# EAGLE design FarmControl (EAGLE 9.6.2)
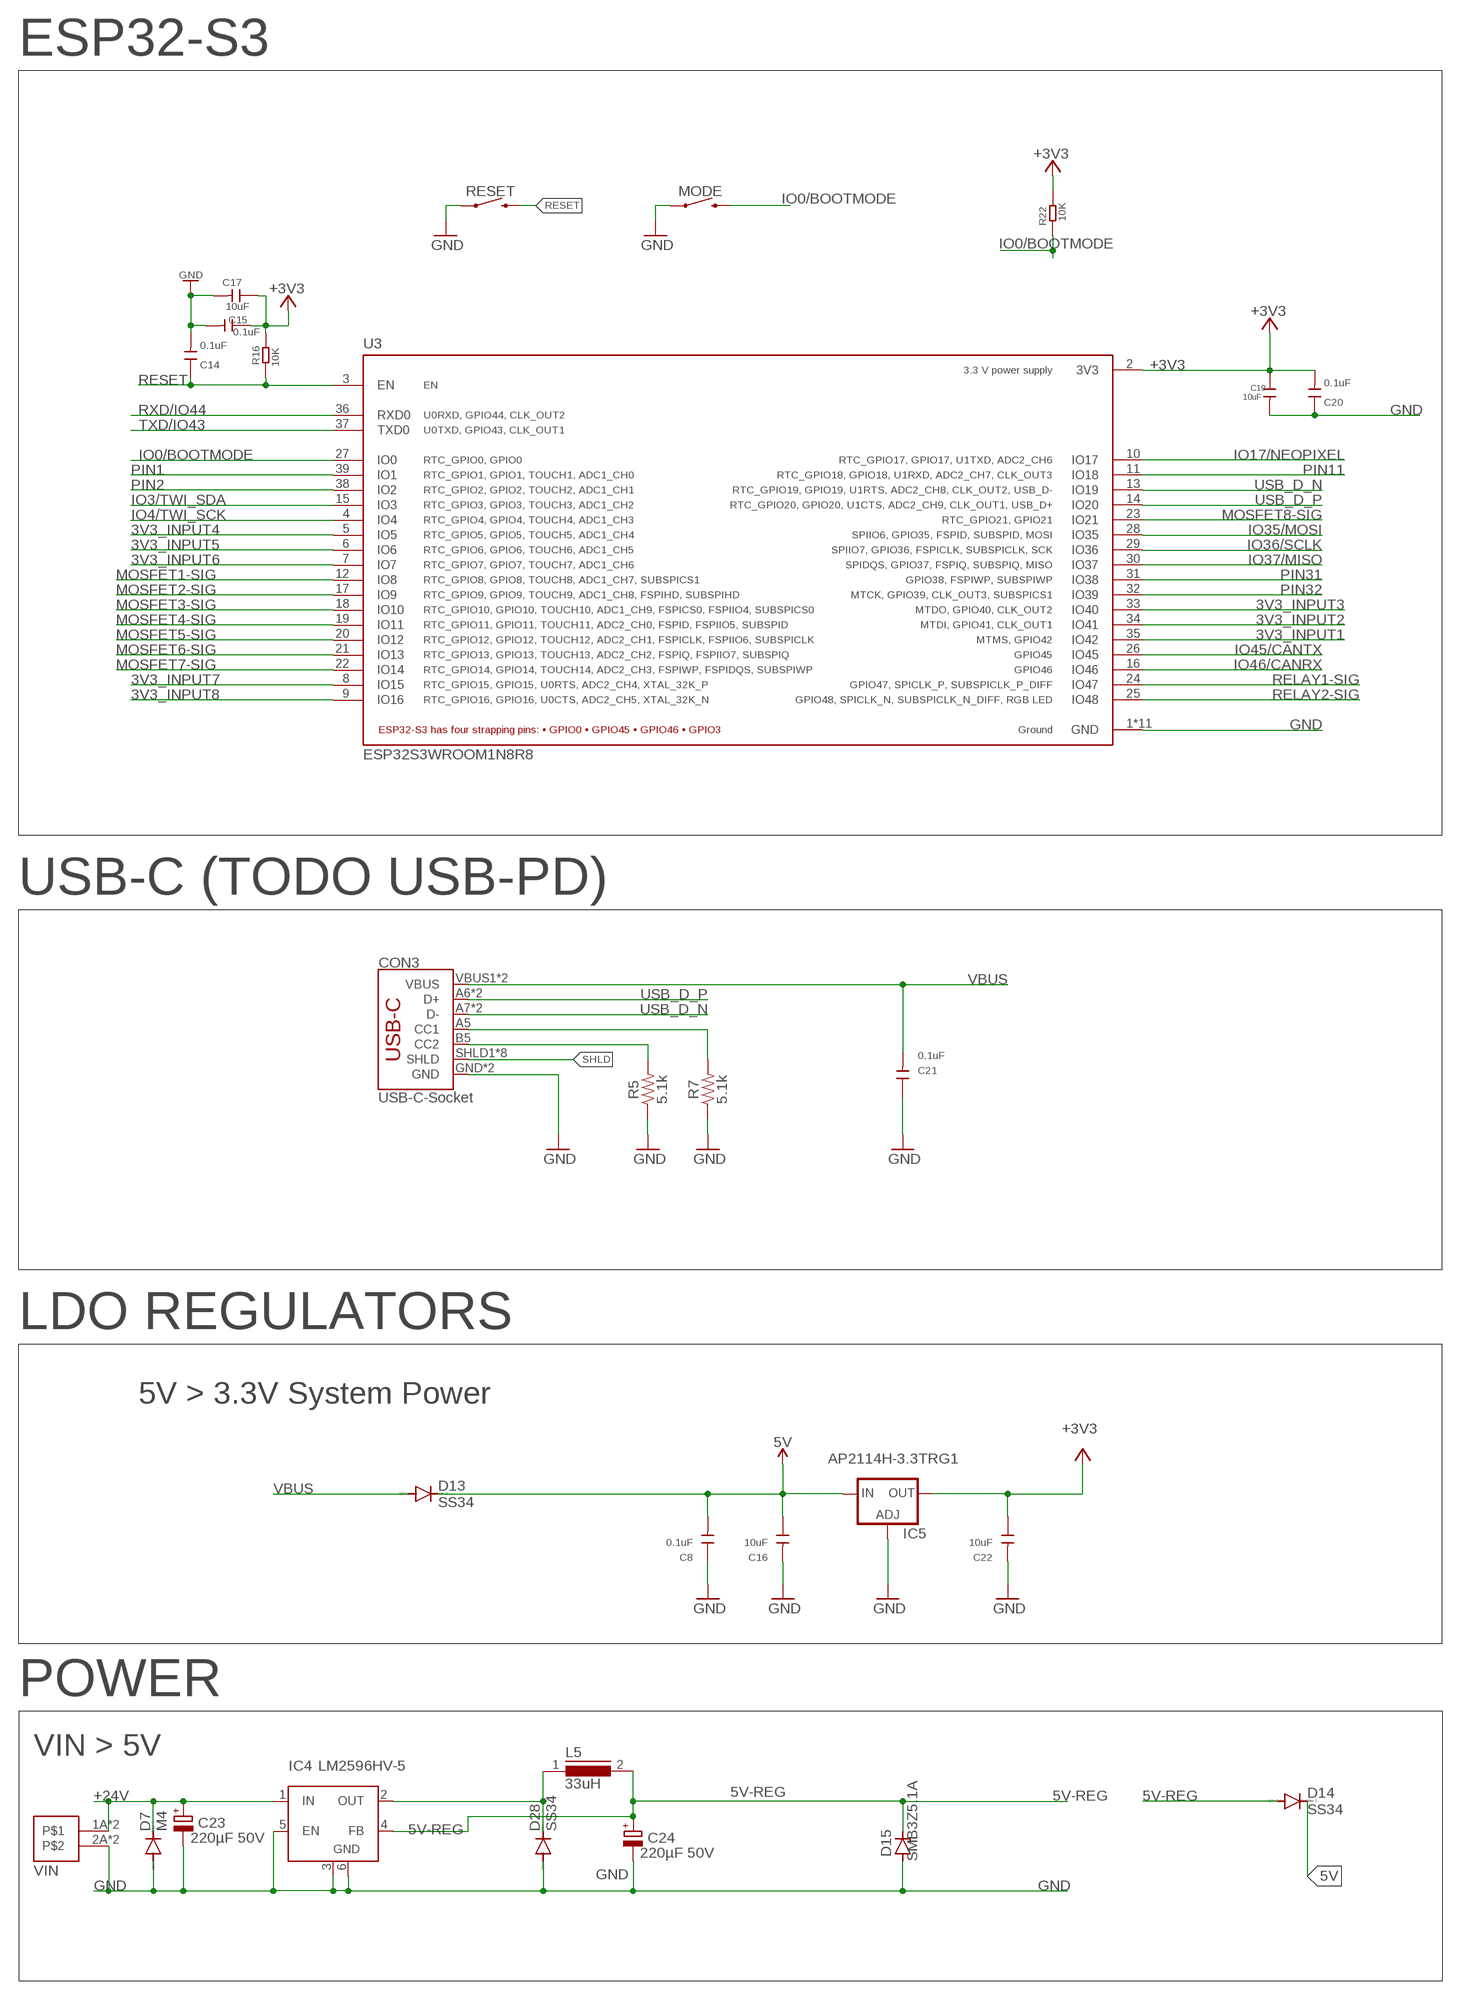
[diagram p0: schematic, sheet 1, part 1 of 3]
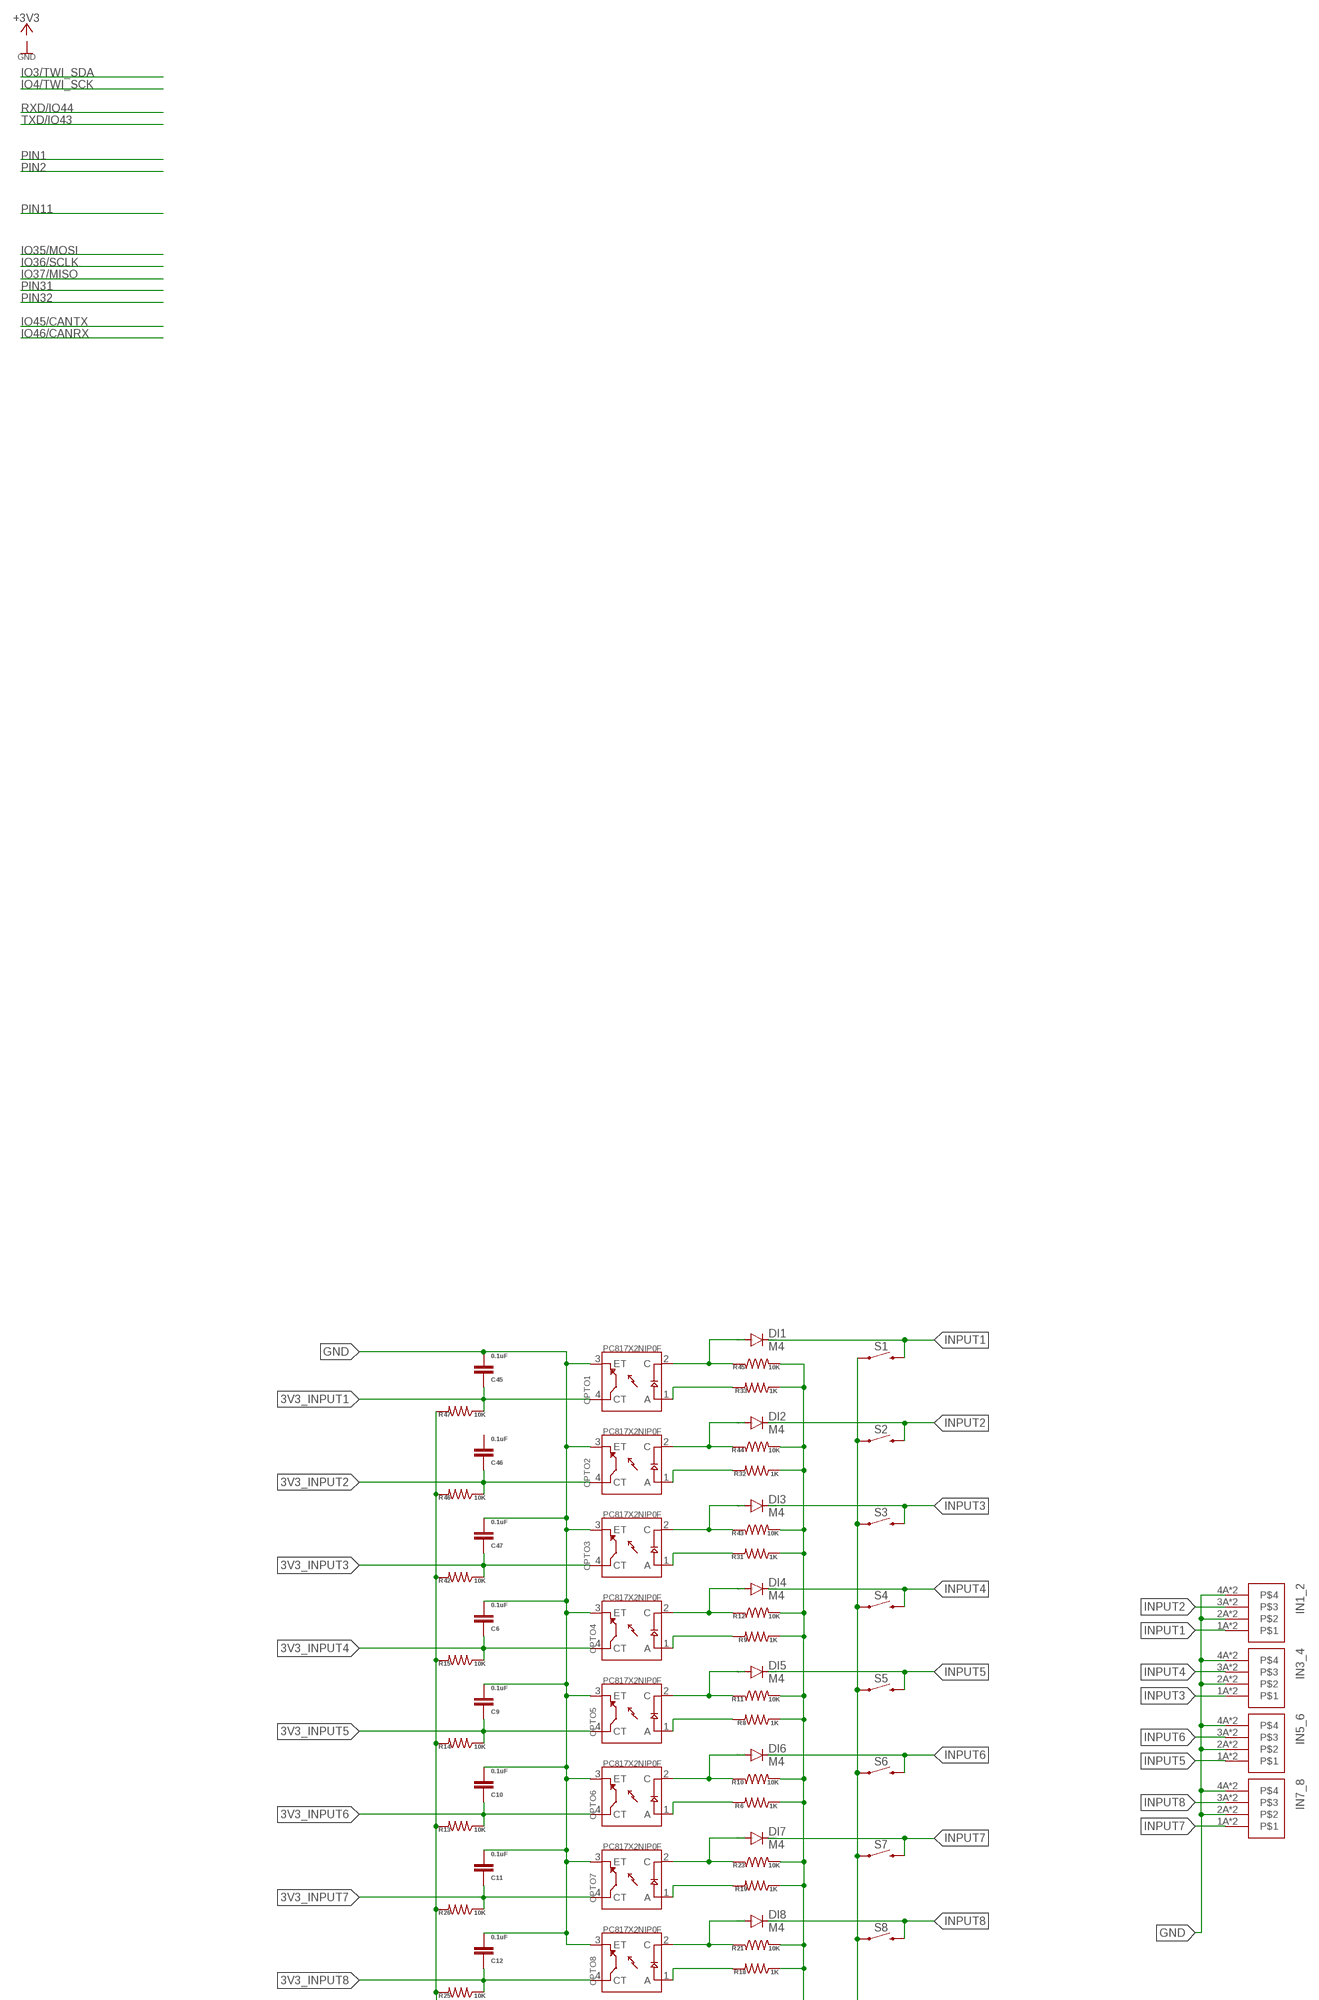
[diagram p1: schematic, sheet 1, part 2 of 3]
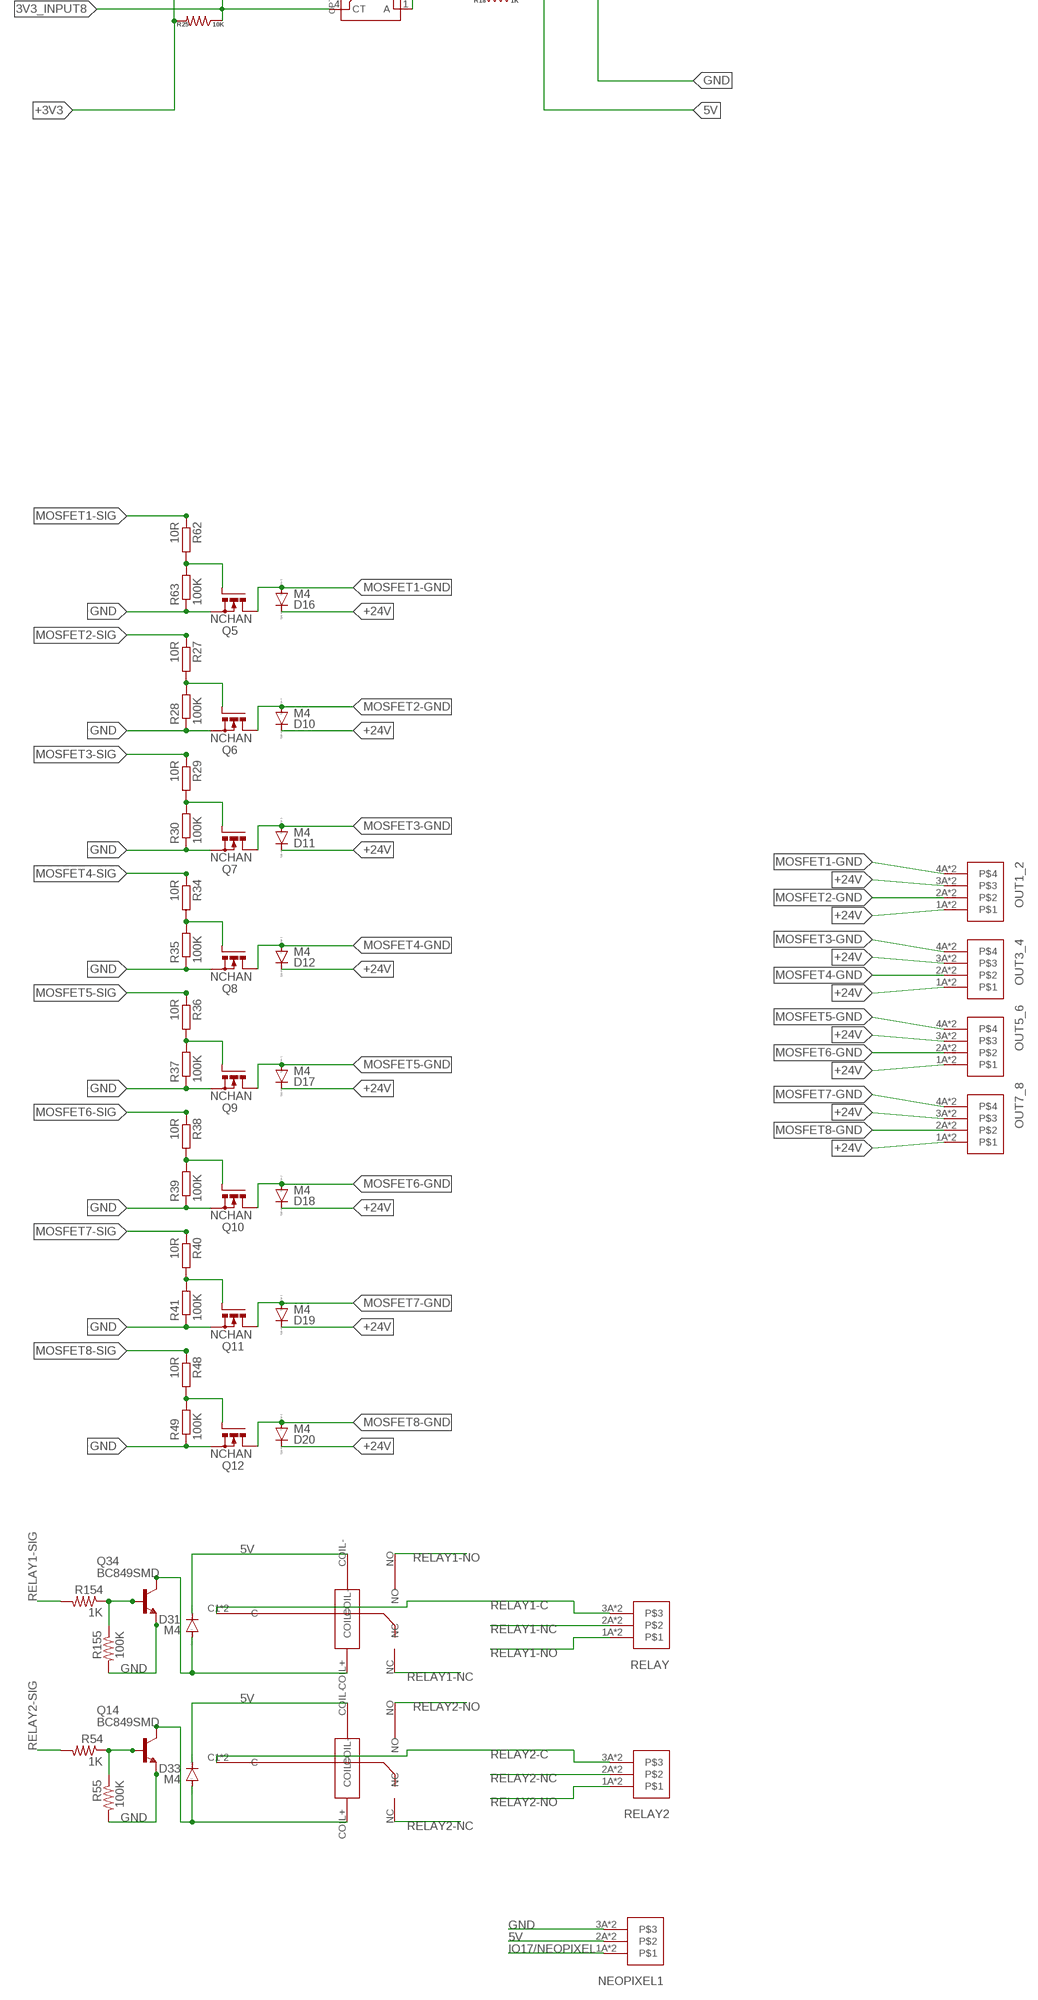
[diagram p2: schematic, sheet 1, part 3 of 3]

## Parts
C6  0.1uF  C-EUC1206  [C1206]
C8  0.1uF  DISCRETE_C-1206  [DISCRETE_C1206]
C9  0.1uF  C-EUC1206  [C1206]
C10  0.1uF  C-EUC1206  [C1206]
C11  0.1uF  C-EUC1206  [C1206]
C12  0.1uF  C-EUC1206  [C1206]
C14  0.1uF  DISCRETE_C-1206  [DISCRETE_C1206]
C15  0.1uF  DISCRETE_C-1206  [DISCRETE_C1206]
C16  10uF  C-1206  [C1206]
C17  10uF  DISCRETE_C-1206  [DISCRETE_C1206]
C19  10uF  C-1206  [C1206]
C20  0.1uF  DISCRETE_C-1206  [DISCRETE_C1206]
C21  0.1uF  DISCRETE_C-1206  [DISCRETE_C1206]
C22  10uF  C-1206  [C1206]
C23  220µF 50V  CPOL-EUE  [PANASONIC_E]
C24  220µF 50V  CPOL-EUE  [PANASONIC_E]
C45  0.1uF  C-EUC1206  [C1206]
C46  0.1uF  C-EUC1206  [C1206]
C47  0.1uF  C-EUC1206  [C1206]
CON3  USB-C-Socket  USB_C16PIN  [USB-C-16P]
D7  M4  DIODE-DO-214AC  [DO-214AC]
D10  M4  DIODE-DO-214AC  [DO-214AC]
D11  M4  DIODE-DO-214AC  [DO-214AC]
D12  M4  DIODE-DO-214AC  [DO-214AC]
D13  SS34  DIODE-DO-214AC  [DO-214AC]
D14  SS34  DIODE-SMB  [SMB]
D15  SMB3Z5.1A  ZENER-DIODESMB  [SMB]
D16  M4  DIODE-DO-214AC  [DO-214AC]
D17  M4  DIODE-DO-214AC  [DO-214AC]
D18  M4  DIODE-DO-214AC  [DO-214AC]
D19  M4  DIODE-DO-214AC  [DO-214AC]
D20  M4  DIODE-DO-214AC  [DO-214AC]
D28  SS34  DIODE-SMB  [SMB]
D31  M4  DIODE-DO-214AC  [DO-214AC]
D33  M4  DIODE-DO-214AC  [DO-214AC]
DI1  M4  DIODE-DO-214AC  [DO-214AC]
DI2  M4  DIODE-DO-214AC  [DO-214AC]
DI3  M4  DIODE-DO-214AC  [DO-214AC]
DI4  M4  DIODE-DO-214AC  [DO-214AC]
DI5  M4  DIODE-DO-214AC  [DO-214AC]
DI6  M4  DIODE-DO-214AC  [DO-214AC]
DI7  M4  DIODE-DO-214AC  [DO-214AC]
DI8  M4  DIODE-DO-214AC  [DO-214AC]
IC4  LM2596HV-5  LM2596S  [TO263-5]
IC5  AP2114H-3.3TRG1  LD117AS33TR  [SOT223]
IN1_2  WJ212R-THR-3.5-4  [WJ212R-THR-3.5-4]
IN3_4  WJ212R-THR-3.5-4  [WJ212R-THR-3.5-4]
IN5_6  WJ212R-THR-3.5-4  [WJ212R-THR-3.5-4]
IN7_8  WJ212R-THR-3.5-4  [WJ212R-THR-3.5-4]
L5  33uH  DR127  [DR127]
MODE  MOMENTARY-SWITCH-SPST-PTH-6.0MM  [TACTILE_SWITCH_PTH_6.0MM]
NEOPIXEL1  WJ212R-THR-3.5-3  [WJ212R-THR-3.5-3]
OPTO1  PC817X2NIP0F  [SOT254P975X400-4N]
OPTO2  PC817X2NIP0F  [SOT254P975X400-4N]
OPTO3  PC817X2NIP0F  [SOT254P975X400-4N]
OPTO4  PC817X2NIP0F  [SOT254P975X400-4N]
OPTO5  PC817X2NIP0F  [SOT254P975X400-4N]
OPTO6  PC817X2NIP0F  [SOT254P975X400-4N]
OPTO7  PC817X2NIP0F  [SOT254P975X400-4N]
OPTO8  PC817X2NIP0F  [SOT254P975X400-4N]
OUT1_2  WJ212R-THR-3.5-4  [WJ212R-THR-3.5-4]
OUT3_4  WJ212R-THR-3.5-4  [WJ212R-THR-3.5-4]
OUT5_6  WJ212R-THR-3.5-4  [WJ212R-THR-3.5-4]
OUT7_8  WJ212R-THR-3.5-4  [WJ212R-THR-3.5-4]
Q5  NCHAN  N-POWER-MOSFETDPAK-MOSFET  [D-PAK_TO252AA]
Q6  NCHAN  N-POWER-MOSFETDPAK-MOSFET  [D-PAK_TO252AA]
Q7  NCHAN  N-POWER-MOSFETDPAK-MOSFET  [D-PAK_TO252AA]
Q8  NCHAN  N-POWER-MOSFETDPAK-MOSFET  [D-PAK_TO252AA]
Q9  NCHAN  N-POWER-MOSFETDPAK-MOSFET  [D-PAK_TO252AA]
Q10  NCHAN  N-POWER-MOSFETDPAK-MOSFET  [D-PAK_TO252AA]
Q11  NCHAN  N-POWER-MOSFETDPAK-MOSFET  [D-PAK_TO252AA]
Q12  NCHAN  N-POWER-MOSFETDPAK-MOSFET  [D-PAK_TO252AA]
Q14  BC849SMD  [SOT23-BEC]
Q34  BC849SMD  [SOT23-BEC]
R5  5.1k  5.1KOHM5.1KOHM-0603-1/10W-1%  [0603@1]
R6  1K  R-US_R1206  [R1206]
R7  5.1k  5.1KOHM5.1KOHM-0603-1/10W-1%  [0603@1]
R8  1K  R-US_R1206  [R1206]
R9  1K  R-US_R1206  [R1206]
R10  10K  R-US_R1206  [R1206]
R11  10K  R-US_R1206  [R1206]
R12  10K  R-US_R1206  [R1206]
R13  10K  R-US_R1206  [R1206]
R14  10K  R-US_R1206  [R1206]
R15  10K  R-US_R1206  [R1206]
R16  10K  R-1206  [R1206]
R18  1K  R-US_R1206  [R1206]
R19  1K  R-US_R1206  [R1206]
R21  10K  R-US_R1206  [R1206]
R22  10K  R-1206  [R1206]
R23  10K  R-US_R1206  [R1206]
R25  10K  R-US_R1206  [R1206]
R26  10K  R-US_R1206  [R1206]
R27  10R  R-EU_R1206  [R1206]
R28  100K  R-EU_R1206  [R1206]
R29  10R  R-EU_R1206  [R1206]
R30  100K  R-EU_R1206  [R1206]
R31  1K  R-US_R1206  [R1206]
R32  1K  R-US_R1206  [R1206]
R33  1K  R-US_R1206  [R1206]
R34  10R  R-EU_R1206  [R1206]
R35  100K  R-EU_R1206  [R1206]
R36  10R  R-EU_R1206  [R1206]
R37  100K  R-EU_R1206  [R1206]
R38  10R  R-EU_R1206  [R1206]
R39  100K  R-EU_R1206  [R1206]
R40  10R  R-EU_R1206  [R1206]
R41  100K  R-EU_R1206  [R1206]
R42  10K  R-US_R1206  [R1206]
R43  10K  R-US_R1206  [R1206]
R44  10K  R-US_R1206  [R1206]
R45  10K  R-US_R1206  [R1206]
R46  10K  R-US_R1206  [R1206]
R47  10K  R-US_R1206  [R1206]
R48  10R  R-EU_R1206  [R1206]
R49  100K  R-EU_R1206  [R1206]
R54  1K  R-US_R1206  [R1206]
R55  100K  R-US_R1206  [R1206]
R62  10R  R-EU_R1206  [R1206]
R63  100K  R-EU_R1206  [R1206]
R154  1K  R-US_R1206  [R1206]
R155  100K  R-US_R1206  [R1206]
RELAY  WJ212R-THR-3.5-3  [WJ212R-THR-3.5-3]
RELAY2  WJ212R-THR-3.5-3  [WJ212R-THR-3.5-3]
RESET  MOMENTARY-SWITCH-SPST-PTH-6.0MM  [TACTILE_SWITCH_PTH_6.0MM]
S1  MOMENTARY-SWITCH-SPST-PTH-6.0MM  [TACTILE_SWITCH_PTH_6.0MM]
S2  MOMENTARY-SWITCH-SPST-PTH-6.0MM  [TACTILE_SWITCH_PTH_6.0MM]
S3  MOMENTARY-SWITCH-SPST-PTH-6.0MM  [TACTILE_SWITCH_PTH_6.0MM]
S4  MOMENTARY-SWITCH-SPST-PTH-6.0MM  [TACTILE_SWITCH_PTH_6.0MM]
S5  MOMENTARY-SWITCH-SPST-PTH-6.0MM  [TACTILE_SWITCH_PTH_6.0MM]
S6  MOMENTARY-SWITCH-SPST-PTH-6.0MM  [TACTILE_SWITCH_PTH_6.0MM]
S7  MOMENTARY-SWITCH-SPST-PTH-6.0MM  [TACTILE_SWITCH_PTH_6.0MM]
S8  MOMENTARY-SWITCH-SPST-PTH-6.0MM  [TACTILE_SWITCH_PTH_6.0MM]
U3  ESP32S3WROOM1N8R8  [XCVR_ESP32S3WROOM1N8R8]
U$1  JRC-21F-4100  [JRC-21F-4100]
U$3  JRC-21F-4100  [JRC-21F-4100]
VIN  WJ212R-THR-3.5-2  [WJ212R-THR-3.5-2]

## Nets
3V3_INPUT1: C45.1 OPTO1.4(CT) R47.1 U3.35(IO42)
3V3_INPUT2: C46.1 OPTO2.4(CT) R46.1 U3.34(IO41)
3V3_INPUT3: C47.1 OPTO3.4(CT) R42.1 U3.33(IO40)
3V3_INPUT4: C6.1 OPTO4.4(CT) R15.1 U3.5(IO5)
3V3_INPUT5: C9.1 OPTO5.4(CT) R14.1 U3.6(IO6)
3V3_INPUT6: C10.1 OPTO6.4(CT) R13.1 U3.7(IO7)
3V3_INPUT7: C11.1 OPTO7.4(CT) R26.1 U3.8(IO15)
3V3_INPUT8: C12.1 OPTO8.4(CT) R25.1 U3.9(IO16)
5V: C8.2 C16.1 D13.C D14.C D31.C D33.C IC5.3(IN) NEOPIXEL1.2A NEOPIXEL1.2B R6.1 R8.1 R9.1 R10.2 R11.2 R12.2 R18.1 R19.1 R21.2 R23.2 R31.1 R32.1 R33.1 R43.2 R44.2 R45.2 U$1.COIL- U$3.COIL-
5V-REG: C24.+ D14.A D15.C IC4.4(FB) L5.2
+3V3: C15.1 C17.1 C19.1 C20.2 C22.1 IC5.4(OUT) R13.2 R14.2 R15.2 R16.2 R22.2 R25.2 R26.2 R42.2 R46.2 R47.2 U3.2(3V3)
+24V: C23.+ D7.C D10.C D11.C D12.C D16.C D17.C D18.C D19.C D20.C IC4.1(IN) OUT1_2.1A OUT1_2.1B OUT1_2.3A OUT1_2.3B OUT3_4.1A OUT3_4.1B OUT3_4.3A OUT3_4.3B OUT5_6.1A OUT5_6.1B OUT5_6.3A OUT5_6.3B OUT7_8.1A OUT7_8.1B OUT7_8.3A OUT7_8.3B VIN.1A VIN.1B
CC1: CON3.A5(CC1) R7.2
CC2: CON3.B5(CC2) R5.2
COIL-1: D31.A Q34.C U$3.COIL+(COIL=)
COIL-2: D33.A Q14.C U$1.COIL+(COIL=)
GND: C6.2 C8.1 C9.2 C10.2 C11.2 C12.2 C14.2 C15.2 C16.2 C17.2 C19.2 C20.1 C21.1 C22.2 C23.- C24.- C45.2 C47.2 CON3.GND CON3.GND2(GND) D7.A D15.A D28.A IC4.3(GND) IC4.5(EN) IC4.6(GND) IC5.1(ADJ) IN1_2.2A IN1_2.2B IN1_2.4A IN1_2.4B IN3_4.2A IN3_4.2B IN3_4.4A IN3_4.4B IN5_6.2A IN5_6.2B IN5_6.4A IN5_6.4B IN7_8.2A IN7_8.2B IN7_8.4A IN7_8.4B MODE.1 NEOPIXEL1.3A NEOPIXEL1.3B OPTO1.3(ET) OPTO2.3(ET) OPTO3.3(ET) OPTO4.3(ET) OPTO5.3(ET) OPTO6.3(ET) OPTO7.3(ET) OPTO8.3(ET) Q5.3(S) Q6.3(S) Q7.3(S) Q8.3(S) Q9.3(S) Q10.3(S) Q11.3(S) Q12.3(S) Q14.E Q34.E R5.1 R7.1 R28.1 R30.1 R35.1 R37.1 R39.1 R41.1 R49.1 R55.2 R63.1 R155.2 RESET.1 S1.1 S2.1 S3.1 S4.1 S5.1 S6.1 S7.1 S8.1 U3.1(GND) U3.40(GND) U3.41_1(GND) U3.41_2(GND) U3.41_3(GND) U3.41_4(GND) U3.41_5(GND) U3.41_6(GND) U3.41_7(GND) U3.41_8(GND) U3.41_9(GND) VIN.2A VIN.2B
INPUT1: DI1.C IN1_2.1A IN1_2.1B S1.3
INPUT2: DI2.C IN1_2.3A IN1_2.3B S2.3
INPUT3: DI3.C IN3_4.1A IN3_4.1B S3.3
INPUT4: DI4.C IN3_4.3A IN3_4.3B S4.3
INPUT5: DI5.C IN5_6.1A IN5_6.1B S5.3
INPUT6: DI6.C IN5_6.3A IN5_6.3B S6.3
INPUT7: DI7.C IN7_8.1A IN7_8.1B S7.3
INPUT8: DI8.C IN7_8.3A IN7_8.3B S8.3
IO0/BOOTMODE: MODE.3 R22.1 U3.27(IO0)
IO3/TWI_SDA: U3.15(IO3)
IO4/TWI_SCK: U3.4(IO4)
IO17/NEOPIXEL: NEOPIXEL1.1A NEOPIXEL1.1B U3.10(IO17)
IO35/MOSI: U3.28(IO35)
IO36/SCLK: U3.29(IO36)
IO37/MISO: U3.30(IO37)
IO45/CANTX: U3.26(IO45)
IO46/CANRX: U3.16(IO46)
MOSFET1-GND: D16.A OUT1_2.4A OUT1_2.4B Q5.4(D)
MOSFET1-SIG: R62.1 U3.12(IO8)
MOSFET2-GND: D10.A OUT1_2.2A OUT1_2.2B Q6.4(D)
MOSFET2-SIG: R27.1 U3.17(IO9)
MOSFET3-GND: D11.A OUT3_4.4A OUT3_4.4B Q7.4(D)
MOSFET3-SIG: R29.1 U3.18(IO10)
MOSFET4-GND: D12.A OUT3_4.2A OUT3_4.2B Q8.4(D)
MOSFET4-SIG: R34.1 U3.19(IO11)
MOSFET5-GND: D17.A OUT5_6.4A OUT5_6.4B Q9.4(D)
MOSFET5-SIG: R36.1 U3.20(IO12)
MOSFET6-GND: D18.A OUT5_6.2A OUT5_6.2B Q10.4(D)
MOSFET6-SIG: R38.1 U3.21(IO13)
MOSFET7-GND: D19.A OUT7_8.4A OUT7_8.4B Q11.4(D)
MOSFET7-SIG: R40.1 U3.22(IO14)
MOSFET8-GND: D20.A OUT7_8.2A OUT7_8.2B Q12.4(D)
MOSFET8-SIG: R48.1 U3.23(IO21)
N$9: OPTO6.1(A) R6.2
N$10: OPTO5.1(A) R8.2
N$11: OPTO4.1(A) R9.2
N$12: DI4.A OPTO4.2(C) R12.1
N$13: Q5.1(G) R62.2 R63.2
N$14: DI5.A OPTO5.2(C) R11.1
N$15: DI6.A OPTO6.2(C) R10.1
N$17: OPTO8.1(A) R18.2
N$18: OPTO7.1(A) R19.2
N$19: DI7.A OPTO7.2(C) R23.1
N$20: DI8.A OPTO8.2(C) R21.1
N$22: Q6.1(G) R27.2 R28.2
N$23: Q7.1(G) R29.2 R30.2
N$24: Q8.1(G) R34.2 R35.2
N$26: Q9.1(G) R36.2 R37.2
N$27: Q10.1(G) R38.2 R39.2
N$28: Q11.1(G) R40.2 R41.2
N$29: Q12.1(G) R48.2 R49.2
N$32: Q14.B R54.1 R55.1
N$78: Q34.B R154.1 R155.1
N$149: OPTO3.1(A) R31.2
N$150: OPTO2.1(A) R32.2
N$151: OPTO1.1(A) R33.2
N$152: DI1.A OPTO1.2(C) R45.1
N$153: DI2.A OPTO2.2(C) R44.1
N$154: DI3.A OPTO3.2(C) R43.1
N$164: D28.C IC4.2(OUT) L5.1
PIN1: U3.39(IO1)
PIN2: U3.38(IO2)
PIN11: U3.11(IO18)
PIN31: U3.31(IO38)
PIN32: U3.32(IO39)
RELAY1-C: RELAY.3A RELAY.3B U$3.C1(C) U$3.C2(C)
RELAY1-NC: RELAY.2A RELAY.2B U$3.NC
RELAY1-NO: RELAY.1A RELAY.1B U$3.NO
RELAY1-SIG: R154.2 U3.24(IO47)
RELAY2-C: RELAY2.3A RELAY2.3B U$1.C1(C) U$1.C2(C)
RELAY2-NC: RELAY2.2A RELAY2.2B U$1.NC
RELAY2-NO: RELAY2.1A RELAY2.1B U$1.NO
RELAY2-SIG: R54.2 U3.25(IO48)
RESET: C14.1 R16.1 RESET.3 U3.3(EN)
RXD/IO44: U3.36(RXD0)
SHLD: CON3.SHLD1(SHLD) CON3.SHLD2(SHLD) CON3.SHLD3(SHLD) CON3.SHLD4(SHLD) CON3.SHLD5(SHLD) CON3.SHLD6(SHLD) CON3.SHLD7(SHLD) CON3.SHLD8(SHLD)
TXD/IO43: U3.37(TXD0)
USB_D_N: CON3.A7(D-) CON3.B7(D-) U3.13(IO19)
USB_D_P: CON3.A6(D+) CON3.B6(D+) U3.14(IO20)
VBUS: C21.2 CON3.VBUS1(VBUS) CON3.VBUS2(VBUS) D13.A
Unconnected: C46.2

## Notes on the sheet
- ESP32-S3
- USB-C (TODO USB-PD)
- LDO REGULATORS
- 5V > 3.3V System Power
- POWER
- VIN > 5V

## Library data of the parts
C6 C9-C12 C45-C47 = rcl:C-EU: CAPACITOR, European symbol; SPICEPREFIX: C
C8 C14 C15 C17 C20 C21 = A9G:DISCRETE_C*: Ceramic Capacitors
C16 C19 C22 = discrete:C*: Ceramic Capacitors
C23 C24 = resistor:CPOL-EU: POLARIZED CAPACITOR, European symbol
CON3 = SparkFun-Connectors:USB_C: USB Type C 16Pin Connector Super Speed pins not available on the 16-pin purely SMD connector so this part is best for USB 2.0 implementations. D1 and D2 are tied together enabling D+/- no matter which way the cable is plugged into the connector. The two channel configuration pins (CC1/2) are exposed. These are normally connected to ground via 5.1k resistors but can be reconfigured for high current/high power applications.; PROD_ID: CONN-14122
D7 D10-D14 D16-D20 D28 D31 D33 DI1-DI8 = diode:DIODE-: DIODE
D15 = diode:ZENER-DIODE: Z-Diode
IC4 = linear:LM2596S: STEP-DOWN VOLTAGE REGULATOR
IC5 = v-reg:LD117A?*: Low drop fixed and adjustable positive voltage regulators 1 A Source: http://www.st.com/stonline/products/literature/ds/7194/ld1117axx.pdf
IN1_2 IN3_4 IN5_6 IN7_8 OUT1_2 OUT3_4 OUT5_6 OUT7_8 = WJ212R-THR-3.5-3.81:WJ212R-THR-3.5-4
L5 = inductors:DR127: High Power Density, High Efficiency, Shielded Inductors Source: coiltronics_dr_series.pdf; SPICEPREFIX: L
MODE RESET S1-S8 = SparkFun-Switches:MOMENTARY-SWITCH-SPST: Momentary Switch (Pushbutton) - SPST Normally-open (NO) SPST momentary switches (buttons, pushbuttons). Variants PTH-12MM - 12mm square, through-hole Momentary Pushbutton Switch - 12mm Square <https://www.sparkfun.com/products/9190> (COM-09190) PTH-6.0MM, PTH-6.0MM-KIT - 6.0mm square, through-hole Mini Pushbutton Switch <https://www.sparkfun.com/products/97> (COM-00097) KIT package intended for soldering kit's - only one side of pads' copper is exposed. PTH-RIGHT-ANGLE-KIT - Right-angle, through-hole Right Angle Tactile Button <https://www.sparkfun.com/products/10791> - Used on SparkFun BigTime Watch Kit <https://www.sparkfun.com/products/11734> SMD-12MM - 12mm square, surface-mount Tactile Button - SMD (12mm) <https://www.sparkfun.com/products/12993> (COM-12993) Used on SparkFun PicoBoard <https://www.sparkfun.com/products/11888> SMD-4.5MM - 4.5mm Square Trackball Switch Used on SparkFun Blackberry Trackballer Breakout <https://www.sparkfun.com/products/13169> SMD-4.6MMX2.8MM - 4.60mm x 2.80mm, surface mount Used on SparkFun SAMD21 Mini Breakout <https://www.sparkfun.com/products/13664> SMD-5.2MM, SMD-5.2-REDUNDANT - 5.2mm square, surface-mount Mini Pushbutton Switch - SMD <https://www.sparkfun.com/products/8720> (COM-08720) Used on Arduino Pro Mini <https://www.sparkfun.com/products/11114> REDUNDANT package connects both switch circuits together SMD-6.0X3.5MM - 6.0 x 3.5mm, surface mount Momentary Reset Switch SMD <https://www.sparkfun.com/products/8229> (COM-08229) SMD-6.2MM-TALL - 6.2mm square, surface mount Tactile Button - SMD (6mm) <https://www.sparkfun.com/products/12992> Used on SparkFun Digital Sandbox <https://www.sparkfun.com/products/12651> SMD-RIGHT-ANGLE - Right-angle, surface mount Used on SparkFun Block for Intel® Edison - Arduino <https://www.sparkfun.com/products/13036>; PROD_ID: SWCH-08441; SF_SKU: COM-00097
NEOPIXEL1 RELAY RELAY2 = WJ212R-THR-3.5-3.81:WJ212R-THR-3.5-3
OPTO1-OPTO8 = PC817X2NIP0F:PC817X2NIP0F: PC817 Series 1 Channel 80 V 5000 Vrms General Purpose Photocoupler - DIP-4 Check availability <https://pricing.snapeda.com/parts/PC817X2NIP0F/Sharp%20Microelectronics/view-part?ref=eda>; AVAILABILITY: In Stock; DESCRIPTION: Optoisolator Transistor Output 5000Vrms 1 Channel 4-SMD; MF: Sharp Microelectronics; MP: PC817X2NIP0F; PACKAGE: SMD-4 Sharp; PRICE: None; PURCHASE-URL: https://pricing.snapeda.com/search/part/PC817X2NIP0F/?ref=eda
Q5-Q12 = Cohesion_parts:N-POWER-MOSFET
Q14 Q34 = transistor-npn:BC849*: NPN Transistor
R5 R7 = SparkFun-Resistors:5.1KOHM; PROD_ID: RES-12083
R6 R8-R15 R18 R19 R21 R23 R25 R26 R31-R33 R42-R47 = resistor:R-US_: RESISTOR, American symbol
R16 R22 = discrete:R*
R27-R30 R34-R41 R48 R49 R62 R63 = resistor:R-EU_: RESISTOR, European symbol
R54 R55 R154 R155 = adafruit:R-US_: RESISTOR, American symbol
U3 = ESP32S3WROOM1N8R8:ESP32S3WROOM1N8R8: Check availability <https://pricing.snapeda.com/parts/ESP32S3WROOM1N8R8/Espressif%20Systems/view-part?ref=eda>; AVAILABILITY: In Stock; DESCRIPTION: Bluetooth, WiFi 802.11b/g/n, Bluetooth v5.0 Transceiver Module 2.4GHz PCB Trace Surface Mount; MF: Espressif Systems; MP: ESP32S3WROOM1N8R8; PACKAGE: None; PRICE: None; PURCHASE-URL: https://pricing.snapeda.com/search/part/ESP32S3WROOM1N8R8/?ref=eda
U$1 U$3 = JRC-21F:JRC-21F-4100
VIN = WJ212R-THR-3.5-3.81:WJ212R-THR-3.5-2

## Net classes
0 default: width 0.203 mm, clearance 0.152 mm

## Board
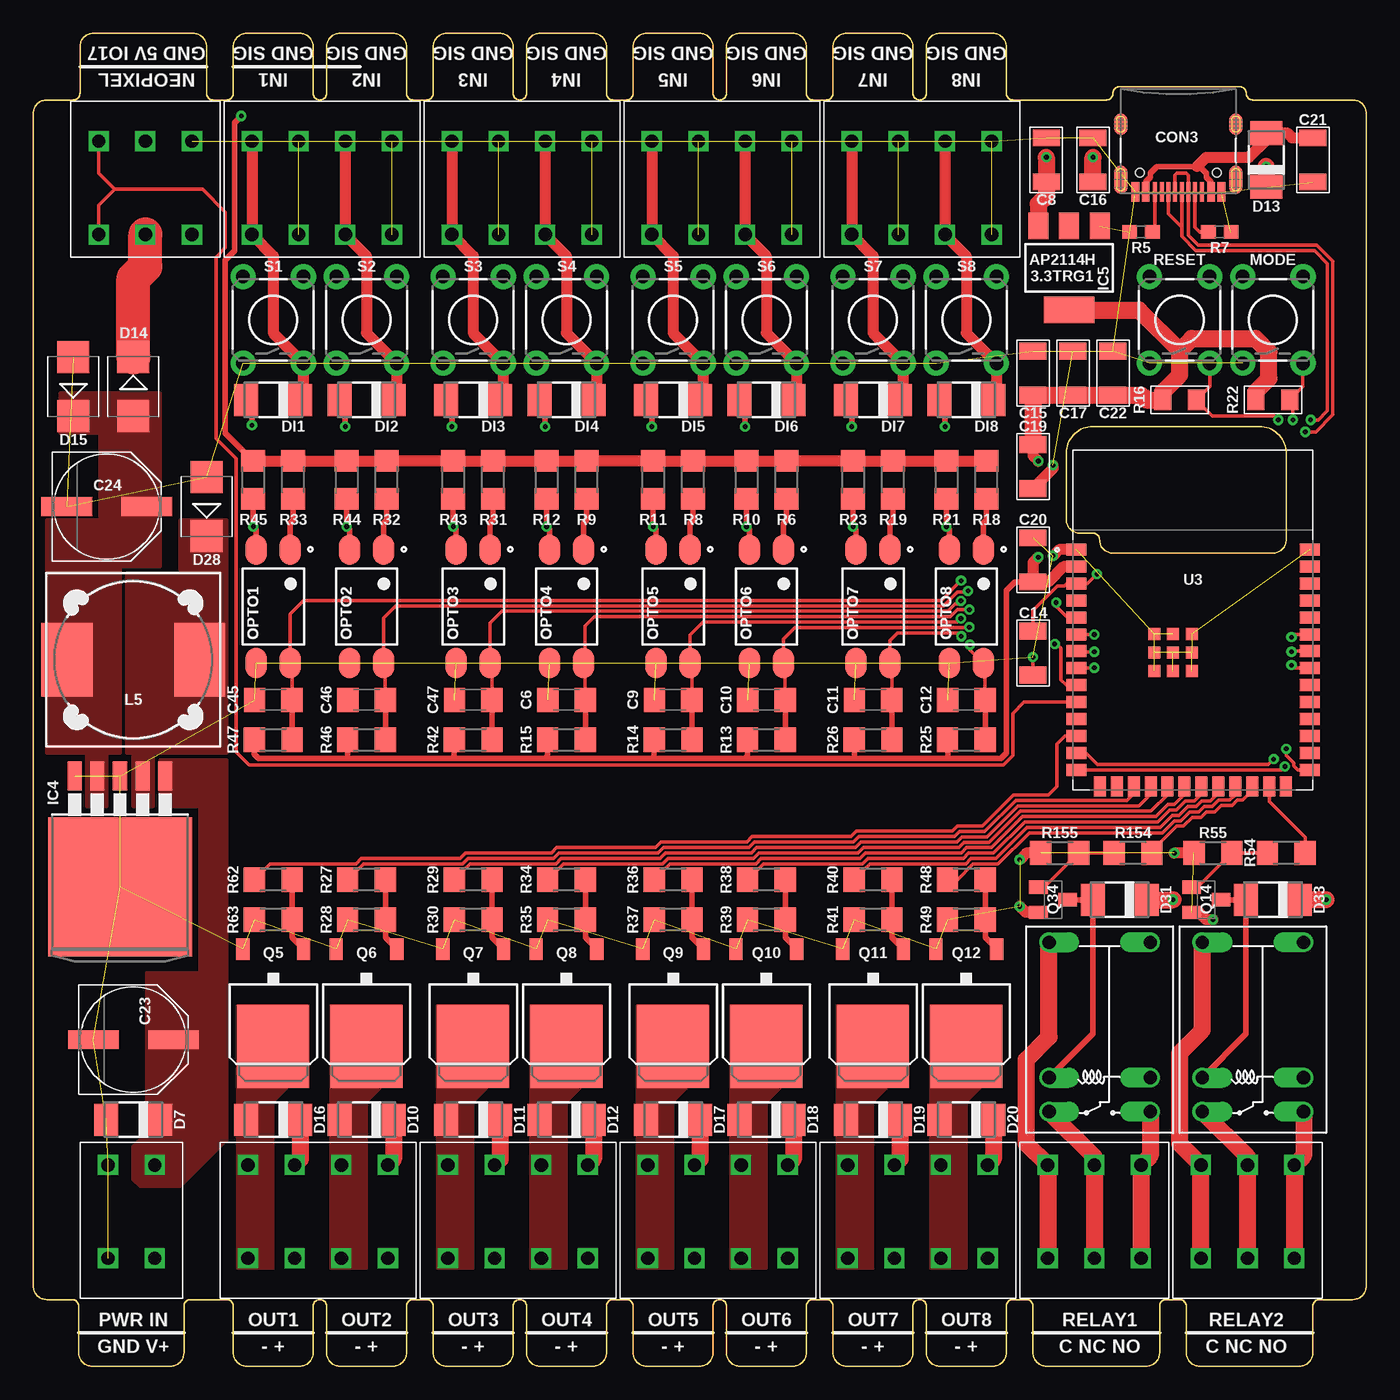
[diagram p3: board, top side]
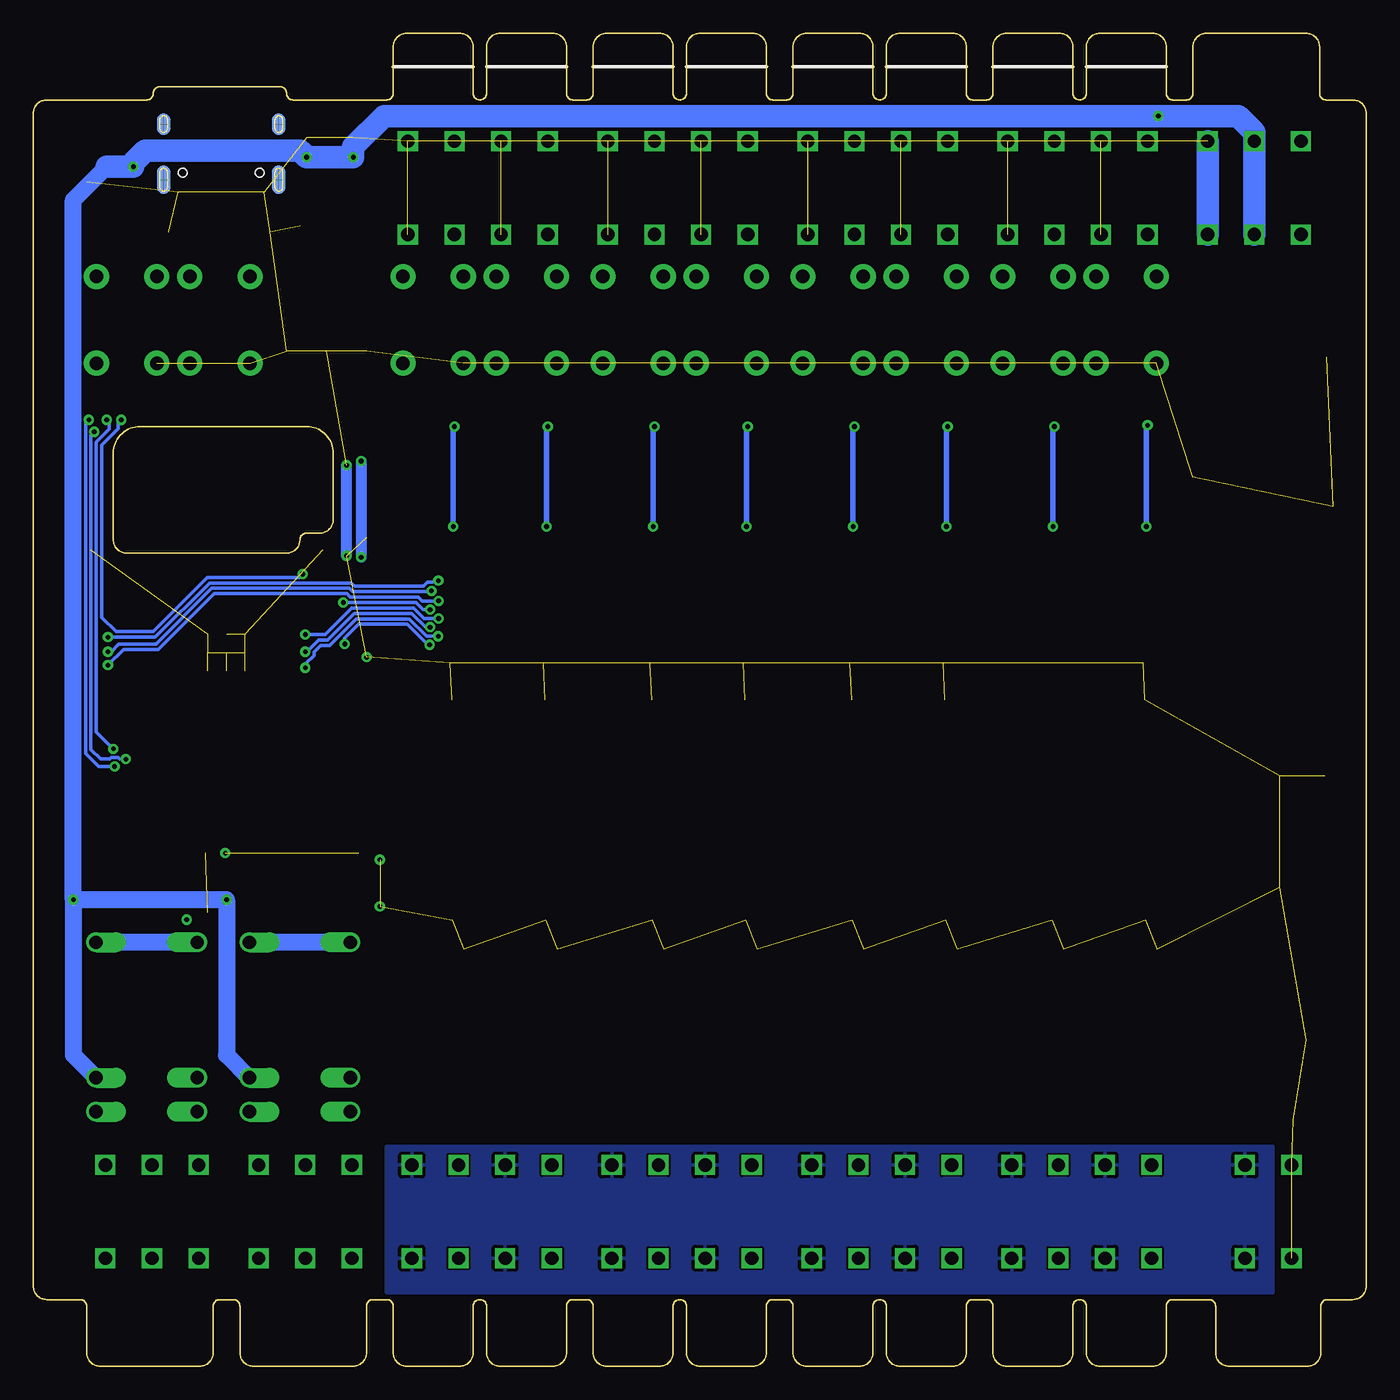
[diagram p4: board, bottom side, seen from below]

Size 100 x 100 mm. Coordinates in mm from the lower left corner, seen from the top.
Outline: 16,100 20,100 arc-90 21,99 21,95.5 arc180 22,95.5 22,99 arc-90 23,100 27,100 arc-90 28,99 28,95.5 arc90 28.5,95 29.5,95 arc90 30,95.5 30,99 arc-90 31,100 35,100 arc-90 36,99 36,95.5 arc180 37,95.5 37,99 arc-90 38,100 42,100 arc-90 43,99 43,95.5 arc90 43.5,95 44.5,95 arc90 45,95.5 45,99 arc-90 46,100 50,100 arc-90 51,99 51,95.5 arc180 52,95.5 52,99 arc-90 53,100 57,100 arc-90 58,99 58,95.5 arc90 58.5,95 59.5,95 arc90 60,95.5 60,99 arc-90 61,100 65,100 arc-90 66,99 66,95.5 arc180 67,95.5 67,99 arc-90 68,100 72,100 arc-90 73,99 73,95.5 arc90 73.5,95 80.5,95 arc90 81,95.5 arc-90 81.5,96 90.5,96 arc-90 91,95.5 arc90 91.5,95 99,95 arc-90 100,94 100,6 arc-90 99,5 96.5,5 arc90 96,4.5 96,1 arc-90 95,0 87.5,0 arc-90 86.5,1 86.5,4.5 arc90 86,5 85,5 arc90 84.5,4.5 84.5,1 arc-90 83.5,0 76,0 arc-90 75,1 75,4.5 arc90 74.5,5 73.5,5 arc90 73,4.5 73,1 arc-90 72,0 68,0 arc-90 67,1 67,4.5 arc180 66,4.5 66,1 arc-90 65,0 61,0 arc-90 60,1 60,4.5 arc90 59.5,5 58.5,5 arc90 58,4.5 58,1 arc-90 57,0 53,0 arc-90 52,1 52,4.5 arc180 51,4.5 51,1 arc-90 50,0 46,0 arc-90 45,1 45,4.5 arc90 44.5,5 43.5,5 arc90 43,4.5 43,1 arc-90 42,0 38,0 arc-90 37,1 37,4.5 arc180 36,4.5 36,1 arc-90 35,0 31,0 arc-90 30,1 30,4.5 arc90 29.5,5 28.5,5 arc90 28,4.5 28,1 arc-90 27,0 23,0 arc-90 22,1 22,4.5 arc180 21,4.5 21,1 arc-90 20,0 16,0 arc-90 15,1 15,4.5 arc90 14.5,5 11.8,5 arc90 11.3,4.5 11.3,1 arc-90 10.3,0 4.4,0 arc-90 3.4,1 3.4,4.5 arc90 2.9,5 1,5 arc-90 0,6 0,94 arc-90 1,95 3,95 arc90 3.5,95.5 3.5,99 arc-90 4.5,100 12,100 arc-90 13,99 13,95.5 arc90 13.5,95 14.5,95
Outline: 14.5,95 arc90 15,95.5
Outline: 16,100 arc90 15,99
Outline: 15,99 15,95.5
Outline: 15,95.5 arc-90 14.5,95
Outline: 15,99 arc-90 16,100
Outline: 94,68.5 94,62 arc-90 93,61 81,61 arc-90 80,62 arc90 79.5,62.5 78.5,62.5 arc-90 77.5,63.5 77.5,68.5 arc-90 79.5,70.5 92,70.5 arc-90 94,68.5
Copper layers (1+2*15+16): Top 0.035mm / dielectric 1.5mm / Route2 0.035mm / dielectric 0.15mm / Route15 0.035mm / dielectric 0.2mm / Bottom 0.035mm
Design rules "default *": minimum track width 6mil, minimum drill 0.35mm, track to track 6mil, track to pad 6mil, pad to pad 6mil, via to via 6mil, smd to smd 6mil, copper to edge 10mil, drill to drill 6mil, minimum pad ring 10mil, minimum via ring 8mil, stop-mask expansion 4mil, vias tented up to drill 20mil, thermal gap 10mil

### Footprints (pad centres in the part's own frame; a part is rotated, then mirrored left to right if it is on the bottom)
C1206 = smd 1.6 x 1.8: 1 -1.4,0; 2 1.4,0
DISCRETE_C1206 = smd 1.27 x 2.032: 1 -1.651,0; 2 1.651,0
C1206' = smd 1.27 x 2.032: 1 -1.651,0; 2 1.651,0
PANASONIC_E = smd 3.8 x 1.4: + 3,0; - -3,0
USB-C-16P = smd 0.3 x 1.45: A5 -1.25,0; A6 -0.25,0; A7 0.25,0; A8 1.25,0; B5 1.75,0; B6 0.75,0; B7 -0.75,0; B8 -1.75,0 | smd 0.6 x 1.45: GND -3.225,0; GND2 3.225,0 | smd 1 x 2.1: SHLD1 -4.32,-0.915; SHLD2 4.32,-0.915 | smd 1 x 2.1 bottom: SHLD3 -4.32,-0.915; SHLD4 4.32,-0.915 | smd 1 x 1.6: SHLD5 -4.32,-5.095; SHLD8 4.32,-5.095 | smd 1 x 1.6 bottom: SHLD6 -4.32,-5.095; SHLD7 4.32,-5.095 | smd 0.55 x 1.45: VBUS1 -2.45,0; VBUS2 2.45,0 | hole 0.65: -2.89,-1.445; 2.89,-1.445
DO-214AC = smd 1.8 x 2.4: A 2.025,0; C -2.025,0
SMB = smd 2.4 x 2.4: A 2.2,0; C -2.2,0
TO263-5 = smd 1.067 x 2.159: 1 -3.404,-5.791; 2 -1.702,-5.791; 3 0,-5.791; 4 1.702,-5.791; 5 3.404,-5.791 | smd 10.8 x 10.41: 6 0,2.54
SOT223 = smd 1.5 x 2: 1 -2.3,-3.15; 2 0,-3.15; 3 2.3,-3.15 | smd 3.8 x 2: 4 0,3.15
WJ212R-THR-3.5-4 = drill 1 square: 1A 12.6,10.6; 1B 12.6,3.6; 2A 9.1,10.6; 2B 9.1,3.6; 3A 5.6,10.6; 3B 5.6,3.6; 4A 2.1,10.6; 4B 2.1,3.6
DR127 = smd 3.85 x 5.5: 1 -4.975,0; 2 4.975,0
TACTILE_SWITCH_PTH_6.0MM = drill 1.016 pad 1.88: 1 -3.251,2.261; 2 3.251,2.261; 3 -3.251,-2.261; 4 3.251,-2.261
WJ212R-THR-3.5-3 = drill 1 square: 1A 9.1,10.6; 1B 9.1,3.6; 2A 5.6,10.6; 2B 5.6,3.6; 3A 2.1,10.6; 3B 2.1,3.6
SOT254P975X400-4N = smd 2.25 x 1.6: 1 -4.25,1.27; 2 -4.25,-1.27; 3 4.25,-1.27; 4 4.25,1.27
D-PAK_TO252AA = smd 1 x 1.6: 1 -2.28,-4.8; 3 2.28,-4.8 | smd 5.4 x 6.2: 4 0,2.5
SOT23-BEC = smd 1 x 1.4: B -0.95,-1.1; C 0,1.1; E 0.95,-1.1
0603@1 = smd 1.1 x 1: 1 -0.85,0; 2 0.85,0
R1206 = smd 1.6 x 1.803: 1 -1.422,0; 2 1.422,0
R1206' = smd 1.27 x 1.524: 1 -1.27,0; 2 1.27,0
XCVR_ESP32S3WROOM1N8R8 = smd 1.5 x 0.9: 1 -8.75,5.26; 2 -8.75,3.99; 3 -8.75,2.72; 4 -8.75,1.45; 5 -8.75,0.18; 6 -8.75,-1.09; 7 -8.75,-2.36; 8 -8.75,-3.63; 9 -8.75,-4.9; 10 -8.75,-6.17; 11 -8.75,-7.44; 12 -8.75,-8.71; 13 -8.75,-9.98; 14 -8.75,-11.25; 27 8.75,-11.25; 28 8.75,-9.98; 29 8.75,-8.71; 30 8.75,-7.44; 31 8.75,-6.17; 32 8.75,-4.9; 33 8.75,-3.63; 34 8.75,-2.36; 35 8.75,-1.09; 36 8.75,0.18; 37 8.75,1.45; 38 8.75,2.72; 39 8.75,3.99; 40 8.75,5.26 | smd 0.9 x 1.5: 15 -6.985,-12.5; 16 -5.715,-12.5; 17 -4.445,-12.5; 18 -3.175,-12.5; 19 -1.905,-12.5; 20 -0.635,-12.5; 21 0.635,-12.5; 22 1.905,-12.5; 23 3.175,-12.5; 24 4.445,-12.5; 25 5.715,-12.5; 26 6.985,-12.5 | smd 0.9 x 0.9: 41_1 -1.5,-2.46; 41_2 -2.9,-2.46; 41_3 -0.1,-2.46; 41_4 -2.9,-3.86; 41_5 -1.5,-3.86; 41_6 -0.1,-3.86; 41_7 -2.9,-1.06; 41_8 -1.5,-1.06; 41_9 -0.1,-1.06
JRC-21F-4100 = drill 1 offset: C1 -4.3,3.8; C2 -4.3,-3.8; COIL+ 5.85,-3.8; COIL- 5.85,3.8; NC 8.4,-3.8; NO 8.4,3.8
WJ212R-THR-3.5-2 = drill 1 square: 1A 5.6,10.6; 1B 5.6,3.6; 2A 2.1,10.6; 2B 2.1,3.6

### Placement (x,y rotation side)
C6  40,50 180 top
C8  76,90.5 270 top
C9  48,50 180 top
C10  55,50 180 top
C11  63,50 180 top
C12  70,50 180 top
C14  75,53.5 270 top
C15  75,74.5 90 top
C16  10uF  [C1206']  79.5,90.5 90 top
C17  78,74.5 90 top
C19  10uF  [C1206']  75,67.5 270 top
C20  75,60.5 270 top
C21  96,90.5 90 top
C22  10uF  [C1206']  81,74.5 90 top
C23  7.5,24.5 0 top
C24  5.5,64.5 0 top
C45  18,50 180 top
C46  25,50 180 top
C47  33,50 180 top
CON3  85.9,88.1 180 top
D7  7.5,18.5 180 top
D10  25,18.5 180 top
D11  33,18.5 180 top
D12  40,18.5 180 top
D13  92.5,90.5 90 top
D14  7.5,73.5 270 top
D15  3,73.5 90 top
D16  18,18.5 180 top
D17  48,18.5 180 top
D18  55,18.5 180 top
D19  63,18.5 180 top
D20  70,18.5 180 top
D28  13,64.5 90 top
D31  81.5,35 180 top
D33  93,35 180 top
DI1  18,72.5 180 top
DI2  25,72.5 180 top
DI3  33,72.5 180 top
DI4  40,72.5 180 top
DI5  48,72.5 180 top
DI6  55,72.5 180 top
DI7  63,72.5 180 top
DI8  70,72.5 180 top
IC4  6.5,38.5 180 top
IC5  77.7,82.4 180 top
IN1_2  29,95.5 180 top
IN3_4  44,95.5 180 top
IN5_6  59,95.5 180 top
IN7_8  74,95.5 180 top
L5  7.5,53 180 top
MODE  93,78.5 90 top
NEOPIXEL1  14,95.5 180 top
OPTO1  18,57 270 top
OPTO2  25,57 270 top
OPTO3  33,57 270 top
OPTO4  40,57 270 top
OPTO5  48,57 270 top
OPTO6  55,57 270 top
OPTO7  63,57 270 top
OPTO8  70,57 270 top
OUT1_2  14,4.5 0 top
OUT3_4  29,4.5 0 top
OUT5_6  44,4.5 0 top
OUT7_8  59,4.5 0 top
Q5  18,26.5 180 top
Q6  25,26.5 180 top
Q7  33,26.5 180 top
Q8  40,26.5 180 top
Q9  48,26.5 180 top
Q10  55,26.5 180 top
Q11  63,26.5 180 top
Q12  70,26.5 180 top
Q14  88,35 270 top
Q34  76.5,35 270 top
R5  83.1,85.1 0 top
R6  56.5,66.5 270 top
R7  89,85.1 180 top
R8  49.5,66.5 270 top
R9  41.5,66.5 270 top
R10  53.5,66.5 90 top
R11  46.5,66.5 90 top
R12  38.5,66.5 90 top
R13  55,47 180 top
R14  48,47 180 top
R15  40,47 180 top
R16  10K  [R1206']  86,72.5 180 top
R18  71.5,66.5 270 top
R19  64.5,66.5 270 top
R21  68.5,66.5 90 top
R22  10K  [R1206']  93,72.5 180 top
R23  61.5,66.5 90 top
R25  70,47 180 top
R26  63,47 180 top
R27  25,36.5 0 top
R28  25,33.5 0 top
R29  33,36.5 0 top
R30  33,33.5 0 top
R31  34.5,66.5 270 top
R32  26.5,66.5 270 top
R33  19.5,66.5 270 top
R34  40,36.5 0 top
R35  40,33.5 0 top
R36  48,36.5 0 top
R37  48,33.5 0 top
R38  55,36.5 0 top
R39  55,33.5 0 top
R40  63,36.5 0 top
R41  63,33.5 0 top
R42  33,47 180 top
R43  31.5,66.5 90 top
R44  23.5,66.5 90 top
R45  16.5,66.5 90 top
R46  25,47 180 top
R47  18,47 180 top
R48  70,36.5 0 top
R49  70,33.5 0 top
R54  94,38.5 0 top
R55  88.5,38.5 180 top
R62  18,36.5 0 top
R63  18,33.5 0 top
R154  82.5,38.5 0 top
R155  77,38.5 180 top
RELAY  74,4.5 0 top
RELAY2  85.5,4.5 0 top
RESET  86,78.5 90 top
S1  18,78.5 90 top
S2  25,78.5 90 top
S3  33,78.5 90 top
S4  40,78.5 90 top
S5  48,78.5 90 top
S6  55,78.5 90 top
S7  63,78.5 90 top
S8  70,78.5 90 top
U3  87,56 0 top
U$1  91.5,27.5 270 top
U$3  80,27.5 270 top
VIN  3.5,4.5 0 top

### Tracks (layer width: path | path; a pad name or v marks a point on that pad's centre or on a via)
3V3_INPUT1  (via drill 0.35)
  Top 0.254: C45.1 19.4,52.62 OPTO1.4 19.27,56.45 20.27,57.45 68.13,57.45 v69.61,58.93 | U3.35 94.61,54.91 v94.4,54.7
  Top 0.406: R47.1 19.42,49.98 C45.1
  Bottom 0.254: v94.4,54.7 90.85,54.7 86.78,58.77 76.14,58.77 75.88,58.51 70.72,58.51 70.41,58.83 69.72,58.83 v69.61,58.93
3V3_INPUT2  (via drill 0.35)
  Top 0.254: C46.1 26.4,52.62 OPTO2.4 26.27,56.15 27.16,57.05 68.3,57.05 69.33,58.07 70.04,58.07 v70.13,58.17 | U3.34 94.44,53.64 v94.4,53.6
  Top 0.406: R46.1 26.42,49.98 C46.1
  Bottom 0.254: v94.4,53.6 94.17,53.6 93.58,54.19 90.78,54.19 86.61,58.36 76.31,58.36 76.05,58.11 70.19,58.11 v70.13,58.17
3V3_INPUT3  (via drill 0.35)
  Top 0.254: C47.1 34.4,52.62 OPTO3.4 34.27,55.75 35.16,56.64 68.63,56.64 69.16,57.16 69.35,57.16 v69.6,57.41 | U3.33 94.62,52.37 v94.4,52.59
  Top 0.406: R42.1 34.42,49.98 C47.1
  Bottom 0.254: v94.4,52.59 v94.4,52.6 93.21,53.79 90.61,53.79 86.44,57.96 76.47,57.96 76.22,57.7 71.12,57.7 70.83,57.41 v69.6,57.41
3V3_INPUT4  (via drill 0.35)
  Top 0.254: C6.1 41.4,52.62 | 41.4,52.62 41.4,55.52 42.11,56.23 68.8,56.23 69.33,56.76 v70.23,56.76 | 41.4,52.62 OPTO4.4 | U3.5 77.57,56.18 76.75,57 v76.75,57.3
  Top 0.406: R15.1 41.42,49.98 C6.1
  Bottom 0.254: v76.75,57.3 v76.74,57.29 71.28,57.29 70.75,56.76 v70.23,56.76
3V3_INPUT5  (via drill 0.35)
  Top 0.254: C9.1 49.4,52.62 OPTO5.4 49.27,54.85 50.25,55.83 69.33,55.83 v69.6,56.1 | v79.6,54.9 U3.6
  Top 0.406: R14.1 49.42,49.98 C9.1
  Bottom 0.254: v79.6,54.9 78.1,54.9 76.11,56.89 71.45,56.89 70.67,56.1 v69.6,56.1
3V3_INPUT6  (via drill 0.35)
  Top 0.254: C10.1 56.4,52.62 OPTO6.4 56.27,54.55 57.14,55.42 70.2,55.42 v70.23,55.44 | v79.6,53.6 78.29,53.6 U3.7
  Top 0.406: R13.1 56.42,49.98 C10.1
  Bottom 0.254: v79.6,53.6 79.5,53.6 78.61,54.49 77.93,54.49 75.94,56.48 71.62,56.48 70.58,55.44 v70.23,55.44
3V3_INPUT7  (via drill 0.35)
  Top 0.254: C11.1 64.4,52.62 OPTO7.4 64.27,54.45 64.83,55.01 69.37,55.01 v69.62,54.76 | v79.6,52.4 78.28,52.4 U3.8
  Top 0.406: R26.1 64.42,49.98 C11.1
  Bottom 0.254: v69.62,54.76 69.65,54.78 70.5,54.78 71.79,56.07 75.78,56.07 77.76,54.09 78.44,54.09 78.94,53.58 78.94,53.33 79.6,52.67 v79.6,52.4
3V3_INPUT8  (via drill 0.35)
  Top 0.254: U3.9 77.5,51.1 77.1,51.5 77.1,53.9 76.81,54.19 v76.64,54.19 | v70.27,54.13 70.27,53.75 OPTO8.4 71.4,52.62 C12.1
  Top 0.406: R25.1 71.42,49.98 C12.1
  Bottom 0.254: v76.64,54.19 76.64,54.64 75.61,55.67 71.96,55.67 70.42,54.13 v70.27,54.13
5V  (via drill 0.35)
  Top 0.406: R45.2 14.4,70.02 14.4,83 15.1,83.7 15.1,93.3 v15.6,93.8
  Top 0.813: R45.2 R33.1 R44.2 R32.1 R43.2 R31.1 R12.2 R9.1 R11.2 R8.1 R10.2 R6.1 R23.2 R19.1 R21.2 R18.1
  Top 1.27: v97,35 D33.C | D31.C v85.5,35 | v92.5,90 D13.C | v76,90.7 C8.2 76,87.8 75.4,87.2 IC5.3 | C16.1 v79.5,90.7
  Top 2.54: D14.C 7.5,81.6 8.4,82.5 NEOPIXEL1.2A
  Bottom 1.27: U$1.COIL- 97,23.35 v97,35 | U$3.COIL- 85.5,23.35 v85.5,35 v97,35 | v97,35 97,87.5 94.5,90
  Bottom 1.7: 94.5,90 v92.5,90 92.5,90.3 91.6,91.2 80,91.2 v79.5,90.7 v76,90.7 76,91.5 73.7,93.8 v15.6,93.8 9.6,93.8 8.4,92.6 NEOPIXEL1.2B NEOPIXEL1.2A
5V-REG
  pour Top (rank 3, no thermals): 5.5,42 4,42 4,46 1,46 1,63.5 5,63.5 5,70 2,70 2,73 9.5,73 9.5,60 6.5,60 6.5,46 5.5,46
+3V3  (via drill 0.35)
  Top 0.406: R47.2 16.58,45.92 16.9,45.6 23.7,45.6 | 23.7,45.6 31.4,45.6 | 31.4,45.6 38.4,45.6 | 38.4,45.6 46.4,45.6 | R14.2 46.58,45.78 46.4,45.6 | R15.2 38.58,45.78 38.4,45.6 | R42.2 31.58,45.78 31.4,45.6 | R46.2 23.58,45.72 23.7,45.6 | C20.2 73.65,58.85 73,58.2 73,46 72.6,45.6 68.6,45.6 | 46.4,45.6 53.4,45.6 | 53.4,45.6 61.6,45.6 | 61.6,45.6 68.6,45.6 | R25.2 68.6,46.98 68.6,45.6 | R26.2 61.6,46.98 61.6,45.6 | R13.2 53.58,45.78 53.4,45.6
  Top 0.813: C19.1 75,68.3 v75.4,67.9 | v75.4,60.7 75,60.3 C20.2 76.15,58.85 77.29,59.99 U3.2
  Top 1.27: C19.1 C15.1 C17.1 C22.1 83.15,72.85 83.5,72.5 R16.2 84.73,73.1 86,74.37 86,76.2 | R22.2 91.73,73.13 92.7,74.1 92.7,76.1 91.7,77.1 86.9,77.1 86,76.2 | IC5.4 82.95,79.25 86,76.2
  Bottom 0.813: v75.4,67.9 v75.4,60.7
+24V
  Top 1.27: D10.C 27.02,15.53 OUT1_2.1A | D16.C 20.02,15.53 OUT1_2.3A | D11.C 35.02,15.53 OUT3_4.3A | D12.C 42.02,15.53 OUT3_4.1A | D17.C 50.02,15.53 OUT5_6.3A | D18.C 57.02,15.53 OUT5_6.1A | D19.C 65.03,15.53 OUT7_8.3A | D20.C 72.03,15.53 OUT7_8.1A
  pour Bottom: 73.5,16.5 73.5,5.5 7,5.5 7,16.5
  pour Top (no thermals): 9.5,42 9.5,45.5 14.5,45.5 14.5,17 11,13.5 8,13.5 7.5,14 7.5,16.5 8.5,17.5 8.5,29.5 12.5,29.5 12.5,42
CC1
  Top 0.254: CON3.A5 87.15,85.45 87.5,85.1 R7.2
CC2
  Top 0.254: CON3.B5 84.15,85.3 R5.2
COIL-1
  Top 0.406: Q34.C D31.A 79.47,24.93 U$3.COIL+
COIL-2
  Top 0.406: Q14.C D33.A 90.97,24.93 U$1.COIL+
GND  (via drill 0.35)  (95 unrouted)
  Top 0.254: C14.2 v75,53.2
  Top 0.813: Q34.E 74.45,34.05 v74,34.5 | Q14.E 87.45,34.05 88,33.5 v88.5,33.5 | R55.2 v85.6,38.5 | R155.2 74.5,38.5 v74,38 | U3.1 76.96,61.26 v76.5,60.8 | v76.5,67.6 76.5,67.35 C19.2
  Bottom 0.813: v76.5,60.8 v76.5,67.6
  Bottom 1.7: NEOPIXEL1.3B NEOPIXEL1.3A
INPUT1
  Top 0.813: DI1.C 20.26,72.74 S1.3 18,77.51 18,83.3 IN1_2.1A IN1_2.1B
INPUT2
  Top 0.813: DI2.C 27.26,72.74 S2.3 25,77.51 25,83.3 IN1_2.3A IN1_2.3B
INPUT3
  Top 0.813: DI3.C 35.26,72.74 S3.3 33,77.51 33,83.3 IN3_4.1A IN3_4.1B
INPUT4
  Top 0.813: DI4.C 42.26,72.74 S4.3 40,77.51 40,83.3 IN3_4.3A IN3_4.3B
INPUT5
  Top 0.813: DI5.C 50.26,72.74 S5.3 48,77.51 48,83.3 IN5_6.1A IN5_6.1B
INPUT6
  Top 0.813: DI6.C 57.26,72.74 S6.3 55,77.51 55,83.3 IN5_6.3A IN5_6.3B
INPUT7
  Top 0.813: DI7.C 65.26,72.74 S7.3 63,77.51 63,83.3 IN7_8.1A IN7_8.1B
INPUT8
  Top 0.813: DI8.C 72.26,72.74 S8.3 70,77.51 70,83.3 IN7_8.3A IN7_8.3B
IO0/BOOTMODE  (via drill 0.35)
  Top 0.254: MODE.3 95.26,73.49 R22.1 94.5,72.27 v94.5,71 | U3.27 94.85,44.75 94.56,45.04 94.56,45.27 94,45.83 v94,46.31
  Bottom 0.254: v94,46.31 95.27,47.59 95.27,69.33 94.3,70.3 94.3,70.9 94.4,71 v94.5,71
IO17/NEOPIXEL
  Top 0.254: U3.10 74.33,49.83 73.48,48.98 73.48,45.8 72.8,45.12 16.18,45.12 15.2,46.1 15.2,68.1 13.7,69.6 13.7,83.2 14.4,83.9 14.4,86.6 12.7,88.3 6.1,88.3 | 6.1,88.3 4.9,87.1 NEOPIXEL1.1A | NEOPIXEL1.1B 4.9,89.5 6.1,88.3
MOSFET1-GND
  pour Top (no thermals): 20.6,27.1 20.6,22.4 18,19.8 18,7.3 15.3,7.3 15.3,27.1
MOSFET1-SIG
  Top 0.254: R62.1 17.78,37.7 24.2,37.7 24.61,38.11 32.03,38.11 32.44,38.51 38.87,38.51 39.27,38.92 46.7,38.92 47.1,39.33 53.53,39.33 53.94,39.73 61.36,39.73 61.77,40.14 68.94,40.14 69.33,40.53 71.2,40.53 73.53,42.86 76.16,42.86 76.8,43.5 76.8,46.7 77.39,47.29 U3.12
MOSFET2-GND
  pour Top (no thermals): 27.6,27.1 27.6,22.4 25,19.8 25,7.3 22.3,7.3 22.3,27.1
MOSFET2-SIG
  Top 0.254: R27.1 24.78,37.7 32.2,37.7 32.61,38.11 39.03,38.11 39.44,38.51 46.87,38.51 47.27,38.92 53.7,38.92 54.1,39.33 61.53,39.33 61.94,39.73 69.11,39.73 69.5,40.12 71.37,40.12 73.7,42.45 82.05,42.45 82.6,43 82.6,43.45 U3.17
MOSFET3-GND
  pour Top (no thermals): 35.6,27.1 35.6,22.4 33,19.8 33,7.3 30.3,7.3 30.3,27.1
MOSFET3-SIG
  Top 0.254: R29.1 32.78,37.7 39.2,37.7 39.61,38.11 47.03,38.11 47.44,38.51 53.87,38.51 54.27,38.92 61.7,38.92 62.1,39.33 69.28,39.33 69.67,39.71 71.54,39.71 73.87,42.05 82.94,42.05 83.83,42.92 U3.18
MOSFET4-GND
  pour Top (no thermals): 42.6,27.1 42.6,22.4 40,19.8 40,7.3 37.3,7.3 37.3,27.1
MOSFET4-SIG
  Top 0.254: R34.1 39.78,37.7 47.2,37.7 47.61,38.11 54.03,38.11 54.44,38.51 61.87,38.51 62.27,38.92 69.45,38.92 69.83,39.31 71.71,39.31 74.04,41.64 83.84,41.64 85.1,42.9 U3.19
MOSFET5-GND
  pour Top (no thermals): 50.6,27.1 50.6,22.4 48,19.8 48,7.3 45.3,7.3 45.3,27.1
MOSFET5-SIG
  Top 0.254: R36.1 47.78,37.7 54.2,37.7 54.61,38.11 62.03,38.11 62.44,38.51 69.61,38.51 70,38.9 71.88,38.9 74.21,41.23 84.21,41.23 85.11,42.14 85.6,42.14 86.36,42.9 U3.20
MOSFET6-GND
  pour Top (no thermals): 57.6,27.1 57.6,22.4 55,19.8 55,7.3 52.3,7.3 52.3,27.1
MOSFET6-SIG
  Top 0.254: R38.1 54.78,37.7 62.2,37.7 62.61,38.11 69.78,38.11 70.17,38.49 72.04,38.49 74.38,40.83 84.37,40.83 85.28,41.73 85.77,41.73 86.44,42.4 87.1,42.4 87.64,42.94 U3.21
MOSFET7-GND
  pour Top (no thermals): 65.6,27.1 65.6,22.4 63,19.8 63,7.3 60.3,7.3 60.3,27.1
MOSFET7-SIG
  Top 0.254: R40.1 62.78,37.7 69.95,37.7 70.34,38.09 72.21,38.09 74.54,40.42 84.54,40.42 85.45,41.33 85.94,41.33 86.61,41.99 87.27,41.99 87.67,42.4 88.3,42.4 88.91,43.01 U3.22
MOSFET8-GND
  pour Top (no thermals): 72.6,27.1 72.6,22.4 70,19.8 70,7.3 67.3,7.3 67.3,27.1
MOSFET8-SIG
  Top 0.254: U3.23 90.17,42.88 89.77,42.47 88.94,42.47 88.47,41.99 87.84,41.99 87.44,41.59 86.77,41.59 86.11,40.92 85.62,40.92 84.71,40.01 74.71,40.01 72.38,37.68 70.51,37.68 69.33,36.5 R48.1
N$9
  Top 0.406: R6.2 56.5,63.5 56.27,63.27 OPTO6.1
N$10
  Top 0.406: R8.2 49.5,63.5 49.27,63.27 OPTO5.1
N$11
  Top 0.406: R9.2 41.5,63.5 41.27,63.27 OPTO4.1
N$12  (via drill 0.35)
  Top 0.406: OPTO4.2 38.73,62.77 v38.5,63 R12.1 | DI4.A 38.4,72.08 v38.4,70.5
  Bottom 0.406: v38.5,63 38.5,70.4 v38.4,70.5
N$13
  Top 0.406: R62.2 R63.2 19.42,32.16 Q5.1
N$14  (via drill 0.35)
  Top 0.406: OPTO5.2 46.73,62.77 v46.5,63 R11.1 | DI5.A 46.4,72.08 v46.4,70.5
  Bottom 0.406: v46.5,63 46.5,70.4 v46.4,70.5
N$15  (via drill 0.35)
  Top 0.406: OPTO6.2 53.73,62.77 v53.5,63 R10.1 | v53.4,70.5 53.4,72.08 DI6.A
  Bottom 0.406: v53.5,63 53.5,70.4 v53.4,70.5
N$17
  Top 0.406: R18.2 71.5,63.5 71.27,63.27 OPTO8.1
N$18
  Top 0.406: R19.2 64.5,63.5 64.27,63.27 OPTO7.1
N$19  (via drill 0.35)
  Top 0.406: OPTO7.2 61.73,62.77 v61.5,63 R23.1 | v61.4,70.5 61.4,72.08 DI7.A
  Bottom 0.406: v61.5,63 61.5,70.4 v61.4,70.5
N$20  (via drill 0.35)
  Top 0.406: OPTO8.2 68.73,62.77 v68.5,63 R21.1 | DI8.A 68.4,72.08 v68.4,70.5
  Bottom 0.406: v68.5,63 68.5,70.4 v68.4,70.5
N$22
  Top 0.406: R27.2 R28.2 26.42,32.16 Q6.1
N$23
  Top 0.406: R29.2 R30.2 34.42,32.16 Q7.1
N$24
  Top 0.406: R34.2 R35.2 41.42,32.16 Q8.1
N$26
  Top 0.406: R36.2 R37.2 49.42,32.16 Q9.1
N$27
  Top 0.406: R38.2 R39.2 56.42,32.16 Q10.1
N$28
  Top 0.406: R40.2 R41.2 64.42,32.16 Q11.1
N$29
  Top 0.406: Q12.1 71.42,32.16 R49.2 R48.2
N$32
  Top 0.254: Q14.B 87.35,35.95 89.9,38.5 R55.1 R54.1
N$78
  Top 0.254: Q34.B 75.87,35.95 R155.1 R154.1
N$149
  Top 0.406: R31.2 34.5,63.5 34.27,63.27 OPTO3.1
N$150
  Top 0.406: R32.2 26.5,63.5 26.27,63.27 OPTO2.1
N$151
  Top 0.406: R33.2 19.5,63.5 19.27,63.27 OPTO1.1
N$152  (via drill 0.35)
  Top 0.406: OPTO1.2 16.73,62.77 v16.5,63 R45.1 | v16.4,70.6 16.4,72.08 DI1.A
  Bottom 0.406: v16.5,63 16.5,70.5 v16.4,70.6
N$153  (via drill 0.35)
  Top 0.406: OPTO2.2 23.73,62.77 v23.5,63 R44.1 | DI2.A 23.4,72.08 v23.4,70.5
  Bottom 0.406: v23.5,63 23.5,70.4 v23.4,70.5
N$154  (via drill 0.35)
  Top 0.406: OPTO3.2 31.73,62.77 v31.5,63 R43.1 | DI3.A 31.4,72.08 v31.4,70.5
  Bottom 0.406: v31.5,63 31.5,70.4 v31.4,70.5
N$164
  pour Top (rank 2, no thermals): 9,42 7.5,42 7.5,46 7,46 7,59.5 11,59.5 11,63.5 14.5,63.5 14.5,46 9,46
RELAY1-C
  Top 1.27: U$3.C2 76.2,24.7 74.5,23 74.5,16.7 RELAY.3A RELAY.3B
  Bottom 1.27: U$3.C2 U$3.C1
RELAY1-NC
  Top 1.27: U$3.NC 79.6,15.7 RELAY.2A RELAY.2B
RELAY1-NO
  Top 1.27: U$3.NO 83.8,15.8 RELAY.1A RELAY.1B
RELAY1-SIG
  Top 0.254: R154.2 83.92,38.65 85.78,40.51 86.27,40.51 86.94,41.18 87.61,41.18 88.01,41.59 88.64,41.59 89.11,42.06 89.94,42.06 90.34,42.47 90.74,42.47 91.44,43.17 U3.24
RELAY2-C
  Top 1.27: RELAY2.3B RELAY2.3A 86,16.7 86,23.5 87.7,25.2 U$1.C2
  Bottom 1.27: U$1.C2 U$1.C1
RELAY2-NC
  Top 1.27: RELAY2.2B RELAY2.2A 91.1,15.7 U$1.NC
RELAY2-NO
  Top 1.27: U$1.NO 95.3,15.8 RELAY2.1A RELAY2.1B
RELAY2-SIG
  Top 0.254: R54.2 95.42,39.68 92.72,42.38 U3.25
RESET  (via drill 0.35)
  Top 0.254: C14.1 75,56.7 76.82,58.52 77.35,58.52 77.55,58.72 U3.3 79.09,58.72 v79.8,59.43 | RESET.3 88.26,73.49 R16.1 88.47,71.3 93.1,71.3 v93.4,71
  Bottom 0.254: v79.8,59.43 80.05,59.18 86.95,59.18 91.02,55.11 93.8,55.11 94.87,56.17 94.87,69.1 93.64,70.33 93.64,70.76 v93.4,71
USB_D_N  (via drill 0.35)
  Top 0.254: U3.13 78.98,46.02 79.84,45.16 92.67,45.16 v93.06,45.54 | v95.43,70.1 96.2,70.1 97.5,71.4 97.5,82.9 96.3,84.1 87.4,84.1 86.65,84.85 CON3.B7 86.65,89.35 86.5,89.5 85.8,89.5 85.65,89.35 CON3.A7
  Bottom 0.254: v93.06,45.54 93.51,45.54 93.63,45.66 94.17,45.66 94.29,45.54 94.94,45.54 95.68,46.28 95.68,69.85 v95.43,70.1
USB_D_P  (via drill 0.35)
  Top 0.254: U3.14 93.65,44.75 v93.9,45 | v95.83,71 96.4,71 97.09,71.69 97.09,82.73 96.13,83.69 87.23,83.69 86.15,84.78 86.15,85.45 | CON3.B6 85.15,86.45 86.15,85.45 | CON3.A6 86.15,85.45
  Bottom 0.254: v93.9,45 95.1,45 96.09,45.99 96.09,70.75 v95.83,71
VBUS
  Top 0.406: CON3.VBUS2 83.45,88.88 83.79,89.22 83.79,89.5 84.29,90 87.3,90 87.5,90 88.01,89.49 88.01,89.22 88.35,88.88 CON3.VBUS1
  Top 0.813: 87.3,90 88,90.7 91.2,90.7 92.5,92 D13.A 94.08,92.53 94.45,92.15 C21.2

### Text on the board
tPlace: GND 5V IO17 | GND SIG | GND SIG | GND SIG | GND SIG | GND SIG | GND SIG | GND SIG | GND SIG | NEOPIXEL | IN1 | IN2 | IN3 | IN4 | IN5 | IN6 | IN7 | IN8 | AP2114H / 3.3TRG1 | PWR IN | OUT1 | OUT2 | OUT3 | OUT4 | OUT5 | OUT6 | OUT7 | OUT8 | RELAY1 | RELAY2 | GND V+ | - + | - + | - + | - + | - + | - + | - + | - + | C NC NO | C NC NO